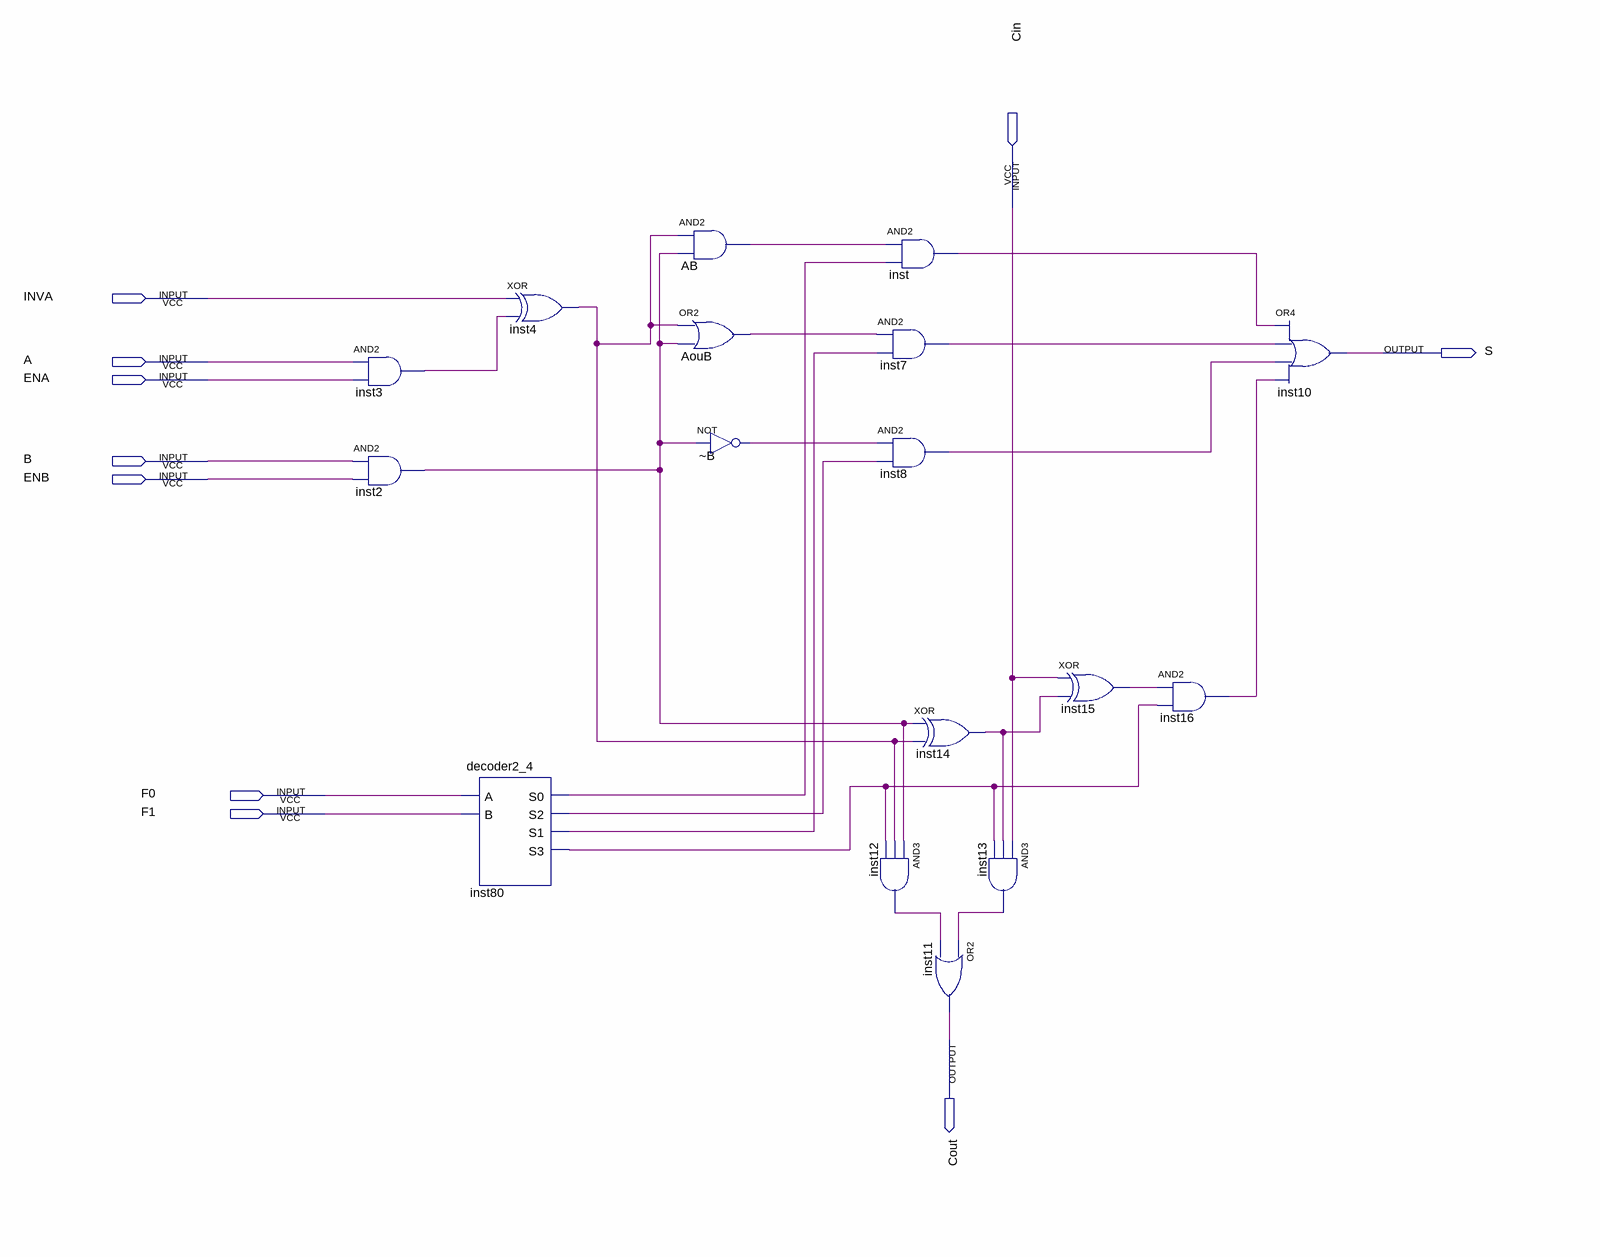
[diagram p0: schematic sheet]
// Quartus schematic ULA_1bit.bdf as structural Verilog: 17 symbols, 10 pins
module ULA_1bit (
  input  Cin,
  input  INVA,
  input  A,
  input  ENA,
  input  B,
  input  ENB,
  input  F0,
  input  F1,
  output S,
  output Cout
);

  wire _B_out, AB_out, AouB_out, inst2_out, inst3_out, inst4_out, inst7_out, inst8_out, inst12_out,
       inst13_out, inst14_out, inst15_out, inst16_out, inst80_s0, inst80_s1, inst80_s2, inst80_s3, inst_out;

  and inst3 (inst3_out, A, ENA);
  and inst2 (inst2_out, B, ENB);
  xor inst4 (inst4_out, INVA, inst3_out);
  decoder2_4 inst80 (.A(F0), .B(F1), .S0(inst80_s0), .S2(inst80_s2), .S1(inst80_s1), .S3(inst80_s3));
  and AB (AB_out, inst4_out, inst2_out);
  or AouB (AouB_out, inst4_out, inst2_out);
  not \u_~B  (_B_out, inst2_out);
  and inst7 (inst7_out, AouB_out, inst80_s1);
  and inst8 (inst8_out, _B_out, inst80_s2);
  and inst12 (inst12_out, inst2_out, inst4_out, inst80_s3);
  and inst (inst_out, AB_out, inst80_s0);
  xor inst14 (inst14_out, inst2_out, inst4_out);
  or inst11 (Cout, inst13_out, inst12_out);
  and inst13 (inst13_out, Cin, inst14_out, inst80_s3);
  xor inst15 (inst15_out, Cin, inst14_out);
  and inst16 (inst16_out, inst15_out, inst80_s3);
  or inst10 (S, inst_out, inst7_out, inst8_out, inst16_out);
endmodule
